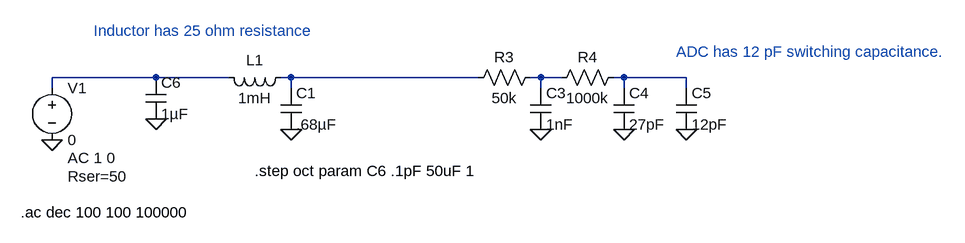
[diagram p0: schematic NewFilter.asc]
NewFilter.asc, the LTspice schematic file:
Version 4
SHEET 1 1476 680
WIRE 240 112 80 112
WIRE 352 112 240 112
WIRE 448 112 432 112
WIRE 736 112 448 112
WIRE 832 112 816 112
WIRE 864 112 832 112
WIRE 960 112 944 112
WIRE 1056 112 960 112
WIRE 80 128 80 112
WIRE 448 128 448 112
WIRE 832 128 832 112
WIRE 960 128 960 112
WIRE 1056 128 1056 112
FLAG 80 208 0
FLAG 448 192 0
FLAG 832 192 0
FLAG 960 192 0
FLAG 1056 192 0
FLAG 240 176 0
SYMBOL cap 432 128 R0
SYMATTR InstName C1
SYMATTR Value .68µF
SYMBOL voltage 80 112 R0
WINDOW 123 24 124 Left 2
WINDOW 39 24 152 Left 2
SYMATTR Value2 AC 1 0
SYMATTR SpiceLine Rser=50
SYMATTR InstName V1
SYMATTR Value 0
SYMBOL res 832 96 R90
WINDOW 0 0 56 VBottom 2
WINDOW 3 32 56 VTop 2
SYMATTR InstName R3
SYMATTR Value 50k
SYMBOL res 960 96 R90
WINDOW 0 0 56 VBottom 2
WINDOW 3 32 56 VTop 2
SYMATTR InstName R4
SYMATTR Value 1000k
SYMBOL cap 816 128 R0
SYMATTR InstName C3
SYMATTR Value 1nF
SYMBOL cap 944 128 R0
SYMATTR InstName C4
SYMATTR Value 27pF
SYMBOL ind 448 96 R90
WINDOW 0 5 56 VBottom 2
WINDOW 3 32 56 VTop 2
SYMATTR InstName L1
SYMATTR Value 1mH
SYMATTR SpiceLine Rser=25
SYMBOL cap 1040 128 R0
SYMATTR InstName C5
SYMATTR Value 12pF
SYMBOL cap 224 112 R0
SYMATTR InstName C6
SYMATTR Value 1µF
TEXT 32 320 Left 2 !.ac dec 100 100 100000
TEXT 144 40 Left 2 ;Inductor has 25 ohm resistance
TEXT 1040 72 Left 2 ;ADC has 12 pF switching capacitance.
TEXT 392 256 Left 2 !.step oct param C6 .1pF 50uF 1

The netlist it stands for:
* NewFilter.asc
C1 N002 0 .68µF
V1 N001 0 0 AC 1 0 Rser=50
R3 N003 N002 50k
R4 N004 N003 1000k
C3 N003 0 1nF
C4 N004 0 27pF
L1 N002 N001 1mH Rser=25
C5 N004 0 12pF
C6 N001 0 1µF
.ac dec 100 100 100000
* Inductor has 25 ohm resistance
* ADC has 12 pF switching capacitance.
.step oct param C6 .1pF 50uF 1
.backanno
.end